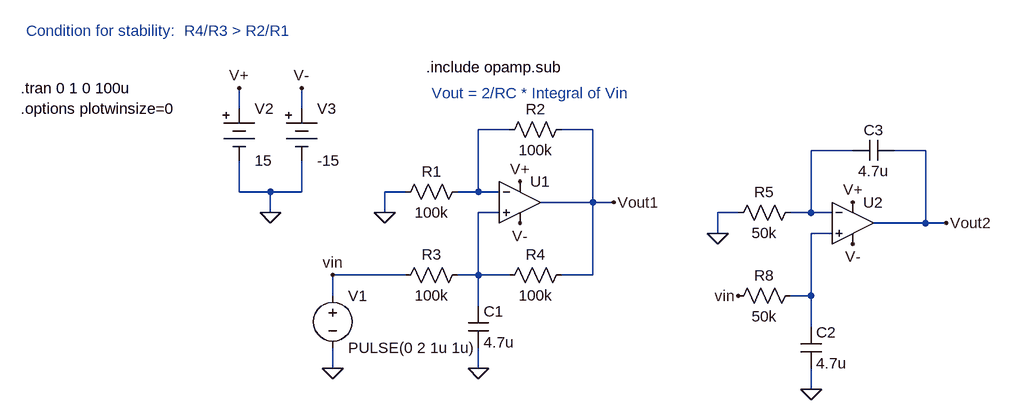
[diagram p0: schematic Non Inverting Miller Integrator3.asc]
Non Inverting Miller Integrator3.asc, the LTspice schematic file:
Version 4
SHEET 1 1032 680
WIRE -272 48 -272 16
WIRE -176 48 -176 16
WIRE 144 80 96 80
WIRE 272 80 224 80
WIRE 672 112 608 112
WIRE 784 112 736 112
WIRE -272 176 -272 128
WIRE -224 176 -272 176
WIRE -176 176 -176 128
WIRE -176 176 -224 176
WIRE -16 176 -48 176
WIRE 96 176 96 80
WIRE 96 176 64 176
WIRE 128 176 96 176
WIRE 272 192 272 80
WIRE 272 192 192 192
WIRE 304 192 272 192
WIRE -224 208 -224 176
WIRE -48 208 -48 176
WIRE 128 208 96 208
WIRE 496 208 464 208
WIRE 608 208 608 112
WIRE 608 208 576 208
WIRE 640 208 608 208
WIRE 784 224 784 112
WIRE 784 224 704 224
WIRE 816 224 784 224
WIRE 464 240 464 208
WIRE 640 240 608 240
WIRE -16 304 -128 304
WIRE 96 304 96 208
WIRE 96 304 64 304
WIRE 144 304 96 304
WIRE 272 304 272 192
WIRE 272 304 224 304
WIRE -128 336 -128 304
WIRE 608 336 608 240
WIRE 608 336 576 336
WIRE 96 352 96 304
WIRE 608 384 608 336
WIRE -128 448 -128 416
WIRE 96 448 96 416
WIRE 608 480 608 448
FLAG -48 208 0
FLAG -128 448 0
FLAG 96 448 0
FLAG 304 192 Vout1
FLAG -224 208 0
FLAG -176 16 V-
FLAG -272 16 V+
FLAG 160 160 V+
FLAG 160 224 V-
FLAG 464 240 0
FLAG 608 480 0
FLAG 816 224 Vout2
FLAG 672 192 V+
FLAG 672 256 V-
FLAG -128 304 vin
FLAG 496 336 vin
SYMBOL res -32 192 R270
WINDOW 0 32 56 VTop 0
WINDOW 3 0 56 VBottom 0
SYMATTR InstName R1
SYMATTR Value 100k
SYMBOL res 128 96 R270
WINDOW 0 32 56 VTop 0
WINDOW 3 0 56 VBottom 0
SYMATTR InstName R2
SYMATTR Value 100k
SYMBOL res 128 320 R270
WINDOW 0 32 56 VTop 0
WINDOW 3 0 56 VBottom 0
SYMATTR InstName R4
SYMATTR Value 100k
SYMBOL res -32 320 R270
WINDOW 0 32 56 VTop 0
WINDOW 3 0 56 VBottom 0
SYMATTR InstName R3
SYMATTR Value 100k
SYMBOL voltage -128 320 R0
WINDOW 123 0 0 Left 0
WINDOW 39 0 0 Left 0
SYMATTR InstName V1
SYMATTR Value PULSE(0 2 1u 1u)
SYMBOL cap 80 352 R0
SYMATTR InstName C1
SYMATTR Value 4.7u
SYMBOL Misc\\battery -272 32 R0
WINDOW 123 0 0 Left 0
WINDOW 39 0 0 Left 0
SYMATTR InstName V2
SYMATTR Value 15
SYMBOL Misc\\battery -176 32 R0
WINDOW 123 0 0 Left 0
WINDOW 39 0 0 Left 0
SYMATTR InstName V3
SYMATTR Value -15
SYMBOL Opamps\\UniversalOpamp2 160 192 R0
SYMATTR InstName U1
SYMBOL res 480 224 R270
WINDOW 0 32 56 VTop 0
WINDOW 3 0 56 VBottom 0
SYMATTR InstName R5
SYMATTR Value 50k
SYMBOL res 480 352 R270
WINDOW 0 32 56 VTop 0
WINDOW 3 0 56 VBottom 0
SYMATTR InstName R8
SYMATTR Value 50k
SYMBOL cap 592 384 R0
SYMATTR InstName C2
SYMATTR Value 4.7u
SYMBOL Opamps\\UniversalOpamp2 672 224 R0
SYMATTR InstName U2
SYMBOL cap 736 96 R90
WINDOW 0 0 32 VBottom 0
WINDOW 3 32 32 VTop 0
SYMATTR InstName C3
SYMATTR Value 4.7u
TEXT -608 16 Left 0 !.tran 0 1 0 100u
TEXT 16 -16 Left 0 !.include opamp.sub
TEXT 24 24 Left 0 ;Vout = 2/RC * Integral of Vin
TEXT -608 48 Left 0 !.options plotwinsize=0
TEXT -600 -72 Left 0 ;Condition for stability:  R4/R3 > R2/R1

The netlist it stands for:
* Non Inverting Miller Integrator3.asc
R1 0 N001 100k
R2 N001 Vout1 100k
R4 N003 Vout1 100k
R3 vin N003 100k
V1 vin 0 PULSE(0 2 1u 1u)
C1 N003 0 4.7u
V2 V+ 0 15
V3 V- 0 -15
XU1 N003 N001 V+ V- Vout1 level.2 Avol=1Meg GBW=10Meg Slew=10Meg ilimit=25m rail=0 Vos=0 phimargin=45 en=0 enk=0 in=0 ink=0 Rin=500Meg  ; pins IN+ IN- V+ V- OUT
R5 0 N002 50k
R8 vin N004 50k
C2 N004 0 4.7u
XU2 N004 N002 V+ V- Vout2 level.2 Avol=1Meg GBW=10Meg Slew=10Meg ilimit=25m rail=0 Vos=0 phimargin=45 en=0 enk=0 in=0 ink=0 Rin=500Meg  ; pins IN+ IN- V+ V- OUT
C3 Vout2 N002 4.7u
.tran 0 1 0 100u
.include opamp.sub
* Vout = 2/RC * Integral of Vin
.options plotwinsize=0
* Condition for stability:  R4/R3 > R2/R1
.lib UniversalOpamps2.sub
.backanno
.end